# Altium schematic sheet Sheet1.SchDoc
size A4; SheetNumber: 1; SheetTotal: 1
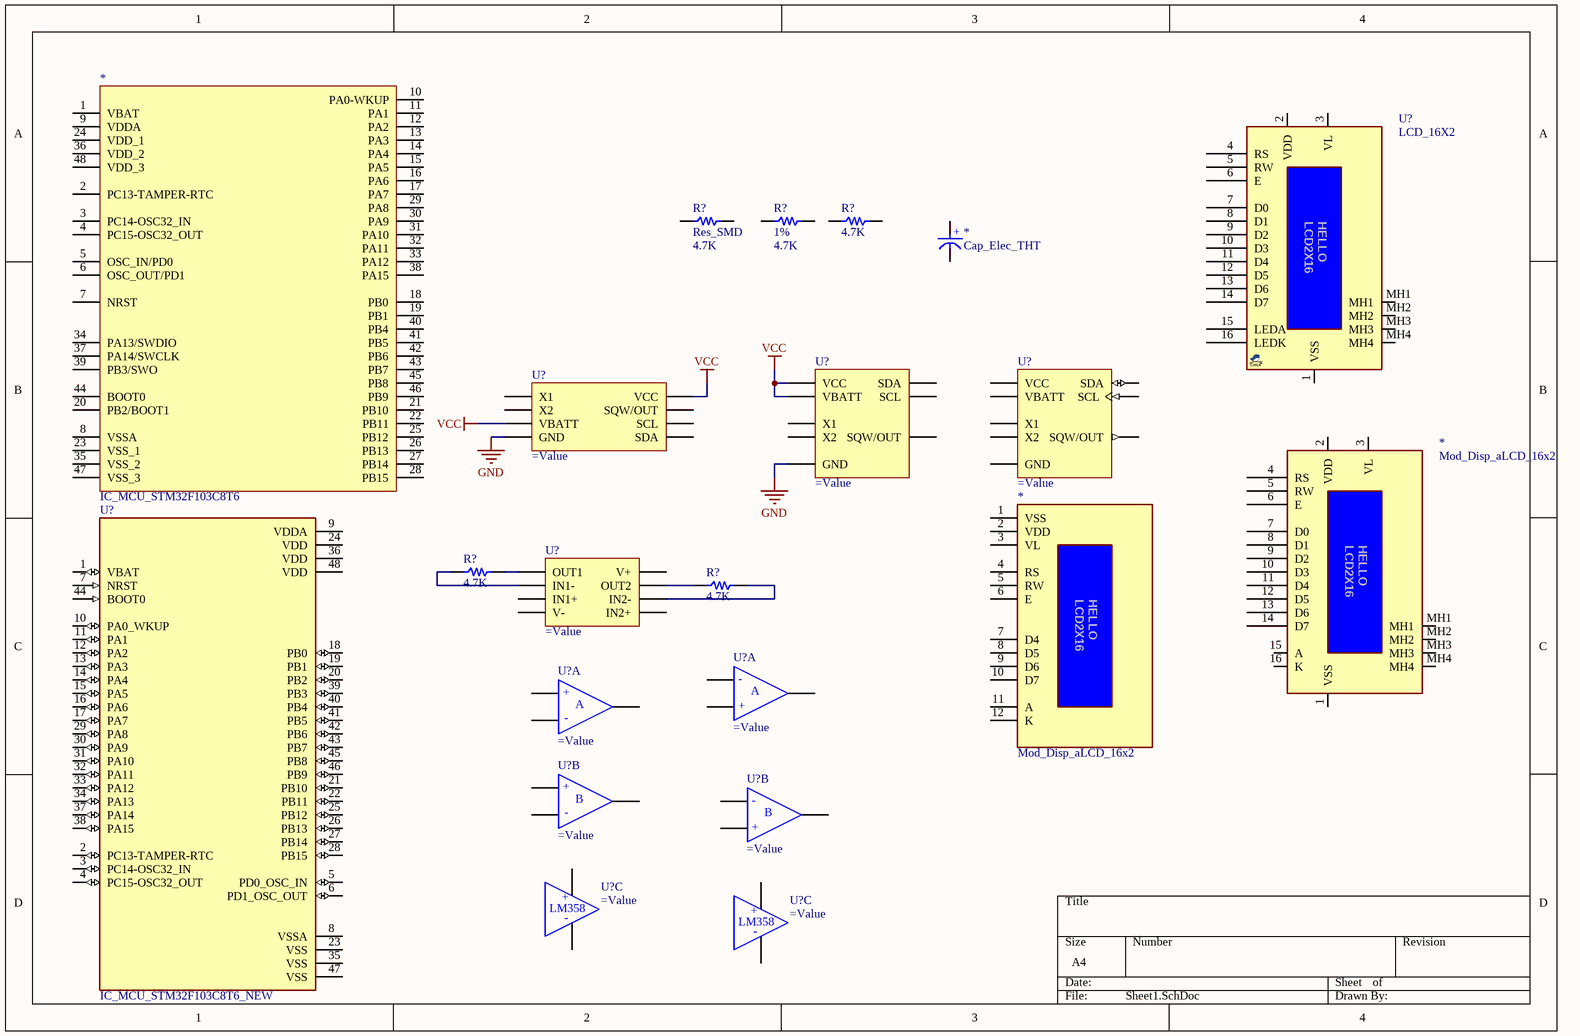
[diagram p0: Sheet1.SchDoc]

## Parts
(Parts that share a designator on the sheet are numbered #1, #2 ... from top to bottom, then left to right.)
*#1  IC_MCU_STM32F103C8T6  [STM32F103C8T6]
*#2  Cap_Elec_THT
*#3  Mod_Disp_aLCD_16x2  [LCDCHAR_16x2_BLU]
*#4  Mod_Disp_aLCD_16x2  [IDC_2X6]
R?#1  Res_SMD  value 4.7K  [Res_SMD_0805]
R?#2  1%  value 4.7K  [Res_SMD_0805]
R?#3  value 4.7K  [Res_SMD_0805]  (hidden comment: LED Blue)
R?#4  4.7K  [Res_SMD_0805]
R?#5  4.7K  [Res_SMD_0805]
U?#1  LCD_16X2  [LCDCHAR_16X2_BLU]
U?#2  (no value)  [PDIP-8]
U?#3  (no value)  [PDIP-8]
U?#4  (no value)  [PDIP-8]
U?#5  (no value)  [PDIP-8]
U?#6  (no value)  [PDIP-8]  (part A of 3)
U?#7  (no value)  [SOIC-8]  (part A of 3)
U?#8  IC_MCU_STM32F103C8T6_NEW  [QFP50P900X900X160-48N]
U?#9  (no value)  [SOIC-8]  (part B of 3)
U?#10  (no value)  [PDIP-8]  (part B of 3)
U?#11  (no value)  [SOIC-8]  (part C of 3)
U?#12  (no value)  [PDIP-8]  (part C of 3)

## Nets
GND: U?#2.4(GND) U?#4.4(GND)
VCC: U?#2.3(VBATT) U?#2.8(VCC) U?#4.3(VBATT) U?#4.8(VCC)
NetR?#4_1: R?#4.1 U?#5.2(IN1-)
NetR?#4_2: R?#4.2 U?#5.1(OUT1)
NetR?#5_1: R?#5.1 U?#5.7(OUT2)
NetR?#5_2: R?#5.2 U?#5.6(IN2-)

Not connected (* = marked no-connect by the designer): *#1 1(VBAT) 2(PC13-TAMPER-RTC) 3(PC14-OSC32_IN) 4(PC15-OSC32_OUT) 5(OSC_IN/PD0) 6(OSC_OUT/PD1) 7(NRST) 8(VSSA) 9(VDDA) 10(PA0-WKUP) 11(PA1) 12(PA2) 13(PA3) 14(PA4) 15(PA5) 16(PA6) 17(PA7) 18(PB0) 19(PB1) 20(PB2/BOOT1) 21(PB10) 22(PB11) 23(VSS_1) 24(VDD_1) 25(PB12) 26(PB13) 27(PB14) 28(PB15) 29(PA8) 30(PA9) 31(PA10) 32(PA11) 33(PA12) 34(PA13/SWDIO) 35(VSS_2) 36(VDD_2) 37(PA14/SWCLK) 38(PA15) 39(PB3/SWO) 40(PB4) 41(PB5) 42(PB6) 43(PB7) 44(BOOT0) 45(PB8) 46(PB9) 47(VSS_3) 48(VDD_3); *#2 N(Negative) P(Positvie); *#3 1(VSS) 2(VDD) 3(VL) 4(RS) 5(RW) 6(E) 7(D0) 8(D1) 9(D2) 10(D3) 11(D4) 12(D5) 13(D6) 14(D7) 15(A) 16(K) MH1 MH2 MH3 MH4; *#4 1(VSS) 2(VDD) 3(VL) 4(RS) 5(RW) 6(E) 7(D4) 8(D5) 9(D6) 10(D7) 11(A) 12(K); R?#1 1 2; R?#2 1 2; R?#3 1 2; U?#1 1(VSS) 2(VDD) 3(VL) 4(RS) 5(RW) 6(E) 7(D0) 8(D1) 9(D2) 10(D3) 11(D4) 12(D5) 13(D6) 14(D7) 15(LEDA) 16(LEDK) MH1 MH2 MH3 MH4; U?#2 1(X1) 2(X2) 5(SDA) 6(SCL) 7(SQW/OUT); U?#3 1(X1) 2(X2) 3(VBATT) 4(GND) 5(SDA) 6(SCL) 7(SQW/OUT) 8(VCC); U?#4 1(X1) 2(X2) 5(SDA) 6(SCL) 7(SQW/OUT); U?#5 3(IN1+) 4(V-) 5(IN2+) 8(V+); U?#6 1(OUT1) 2(IN1-) 3(IN1+); U?#7 1(OUT1) 2(IN1-) 3(IN1+); U?#8 1(VBAT) 2(PC13-TAMPER-RTC) 3(PC14-OSC32_IN) 4(PC15-OSC32_OUT) 5(PD0_OSC_IN) 6(PD1_OSC_OUT) 7(NRST) 8(VSSA) 9(VDDA) 10(PA0_WKUP) 11(PA1) 12(PA2) 13(PA3) 14(PA4) 15(PA5) 16(PA6) 17(PA7) 18(PB0) 19(PB1) 20(PB2) 21(PB10) 22(PB11) 23(VSS) 24(VDD) 25(PB12) 26(PB13) 27(PB14) 28(PB15) 29(PA8) 30(PA9) 31(PA10) 32(PA11) 33(PA12) 34(PA13) 35(VSS) 36(VDD) 37(PA14) 38(PA15) 39(PB3) 40(PB4) 41(PB5) 42(PB6) 43(PB7) 44(BOOT0) 45(PB8) 46(PB9) 47(VSS) 48(VDD); U?#9 5(IN2+) 6(IN2-) 7(OUT2); U?#10 5(IN2+) 6(IN2-) 7(OUT2); U?#11 4(V-) 8(V+); U?#12 4(V-) 8(V+)

## Notes on the sheet
- (in symbol Cap_Elec_THT) +
- (in symbol IC_OpAmp_LM358, part A) +; A; -
- (in symbol IC_OpAmp_LM358, part B) +; B; -
- (in symbol IC_OpAmp_LM358, part C) +; LM358; -
- (in symbol LCDCHAR_16X2_BLU) LCD2X16; HELLO
- (in symbol Mod_Disp_aLCD_16x2) LCD2X16; HELLO

## Library data of the parts
R?#1-R?#5 = Res_SMD: Rating: 0.125W; Type: 1%; Package: 0805
  R?#4 R?#5: Value: 4.7K
U?#1 = LCDCHAR_16X2_BLU: LCD Character Disp, 16X2; MANF: Newhaven; MANF_P#: NHD-0216K3Z-NSW-BBW-V3; PARAM2: Blue back, White, 5V; PARAM: 2 lines x 16 characters; VALUE: LCD_16X2
U?#2-U?#4 = IC_RTC_DS1307
U?#5-U?#7 U?#9-U?#12 = IC_OpAmp_LM358
U?#8 = IC_MCU_STM32F103C8T6_NEW: ARM® Cortex®-M3 STM32F1 Microcontroller IC 32-Bit 72MHz 64KB (64K x 8) FLASH 48-LQFP (7x7); MF: STMicroelectronics; SnapEDA_Link: https://www.snapeda.com/parts/STM32F103C8T6/STMicroelectronics/view-part/?ref=snap; Package: LQFP-48 STMicroelectronics; Value: *; MP: STM32F103C8T6; Check_prices: https://www.snapeda.com/parts/STM32F103C8T6/STMicroelectronics/view-part/?ref=eda